# Altium schematic sheet 01 SoM IO INTERFACE.SchDoc
size A2; SheetNumber: 2; SheetTotal: 10
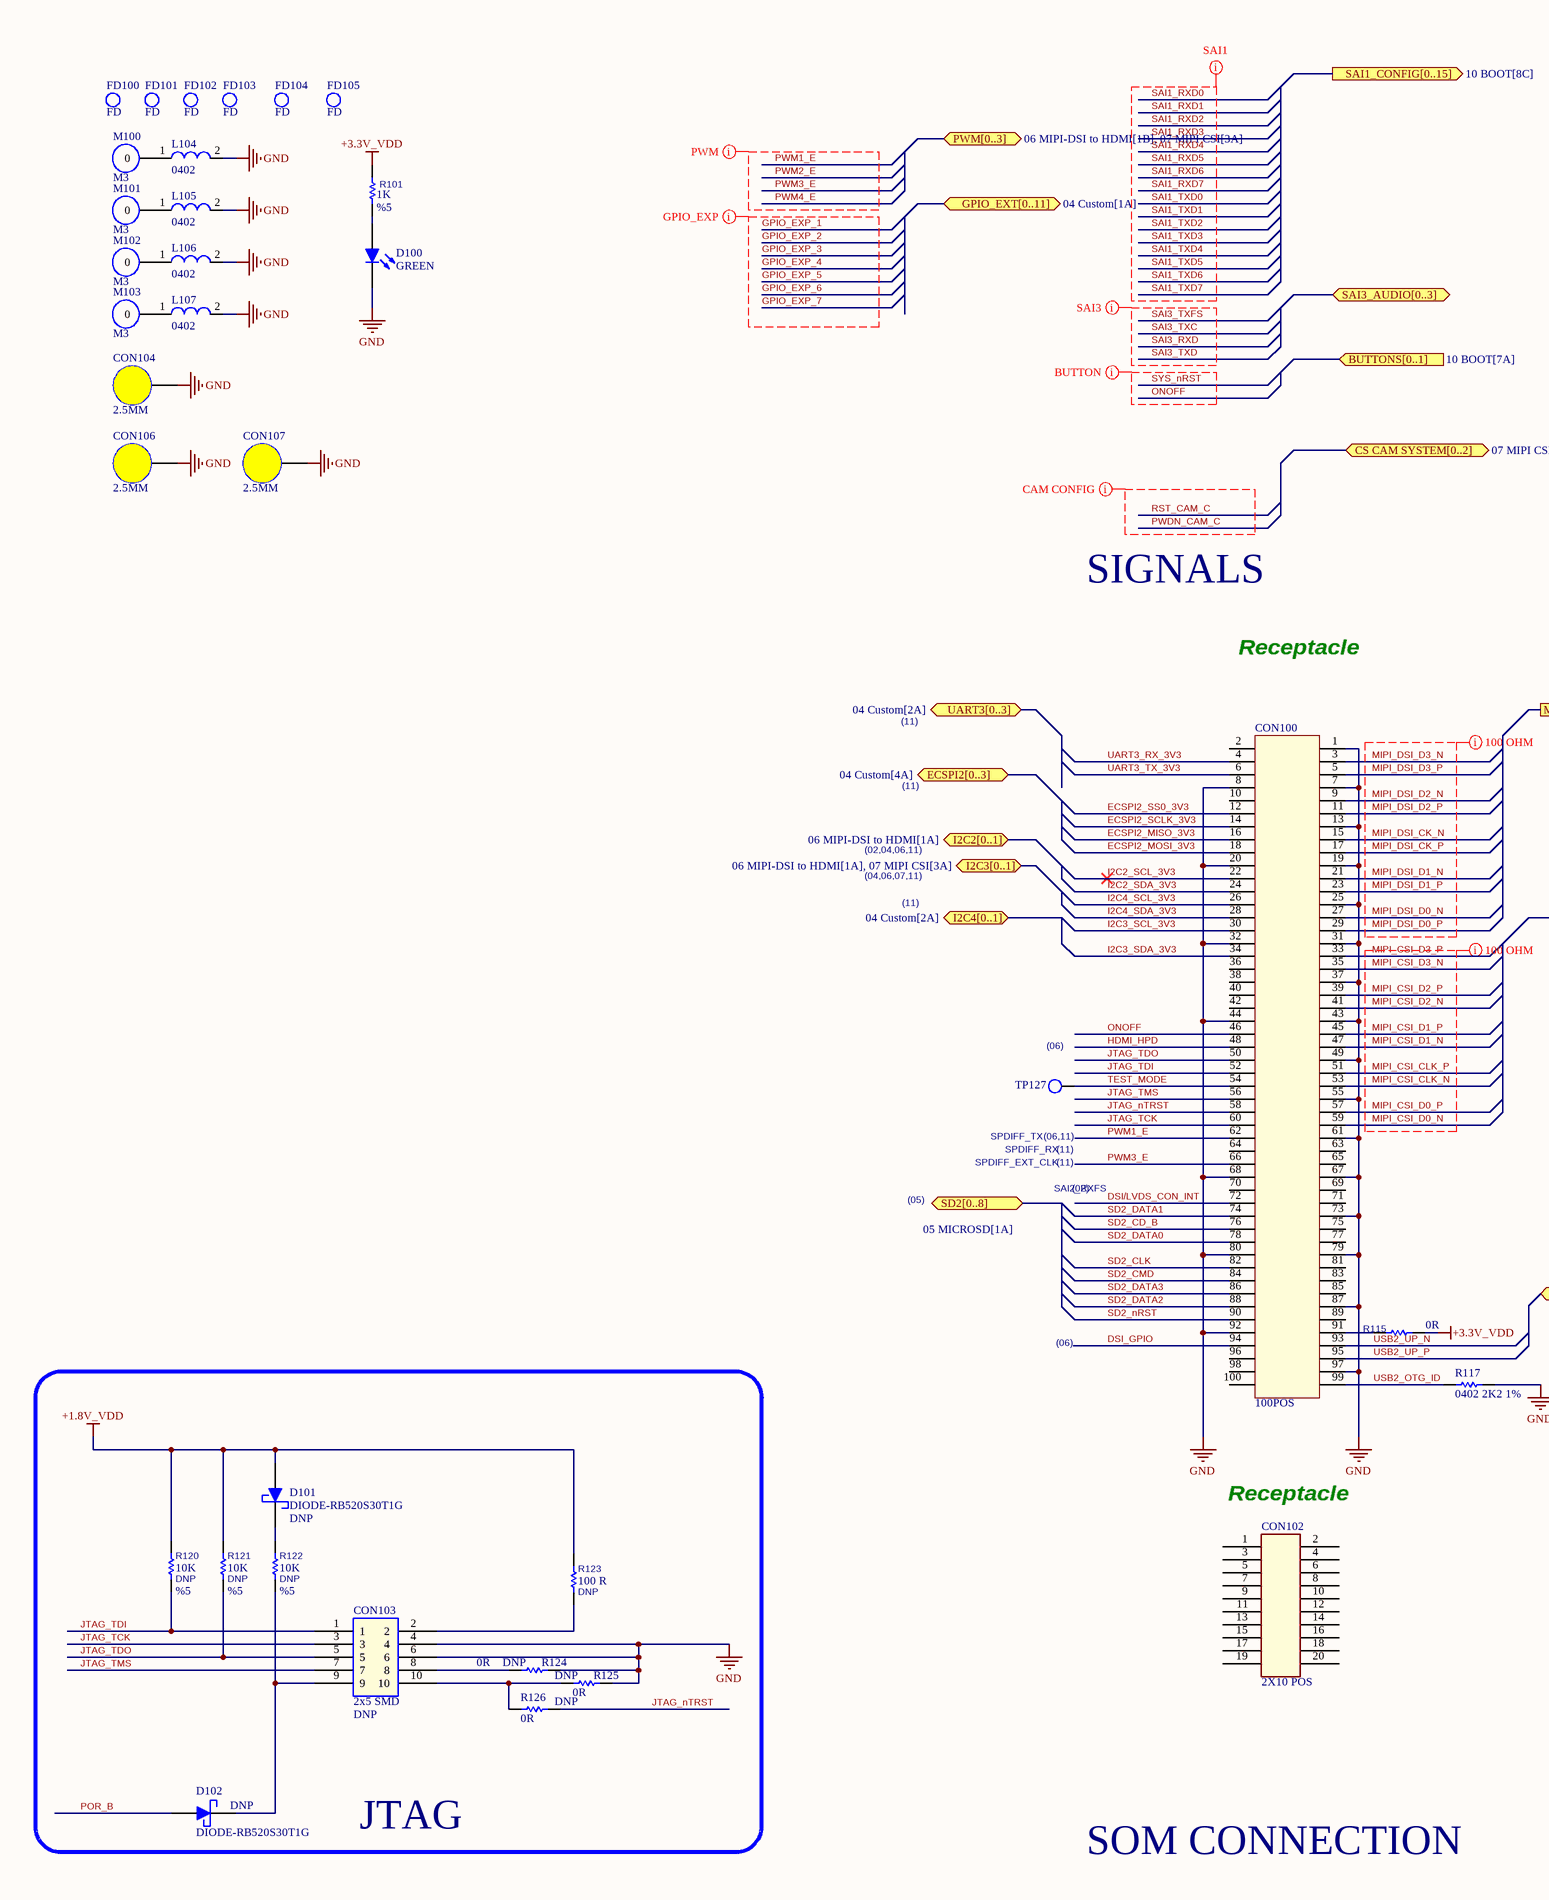
[diagram p0: 01 SoM IO INTERFACE.SchDoc, left]
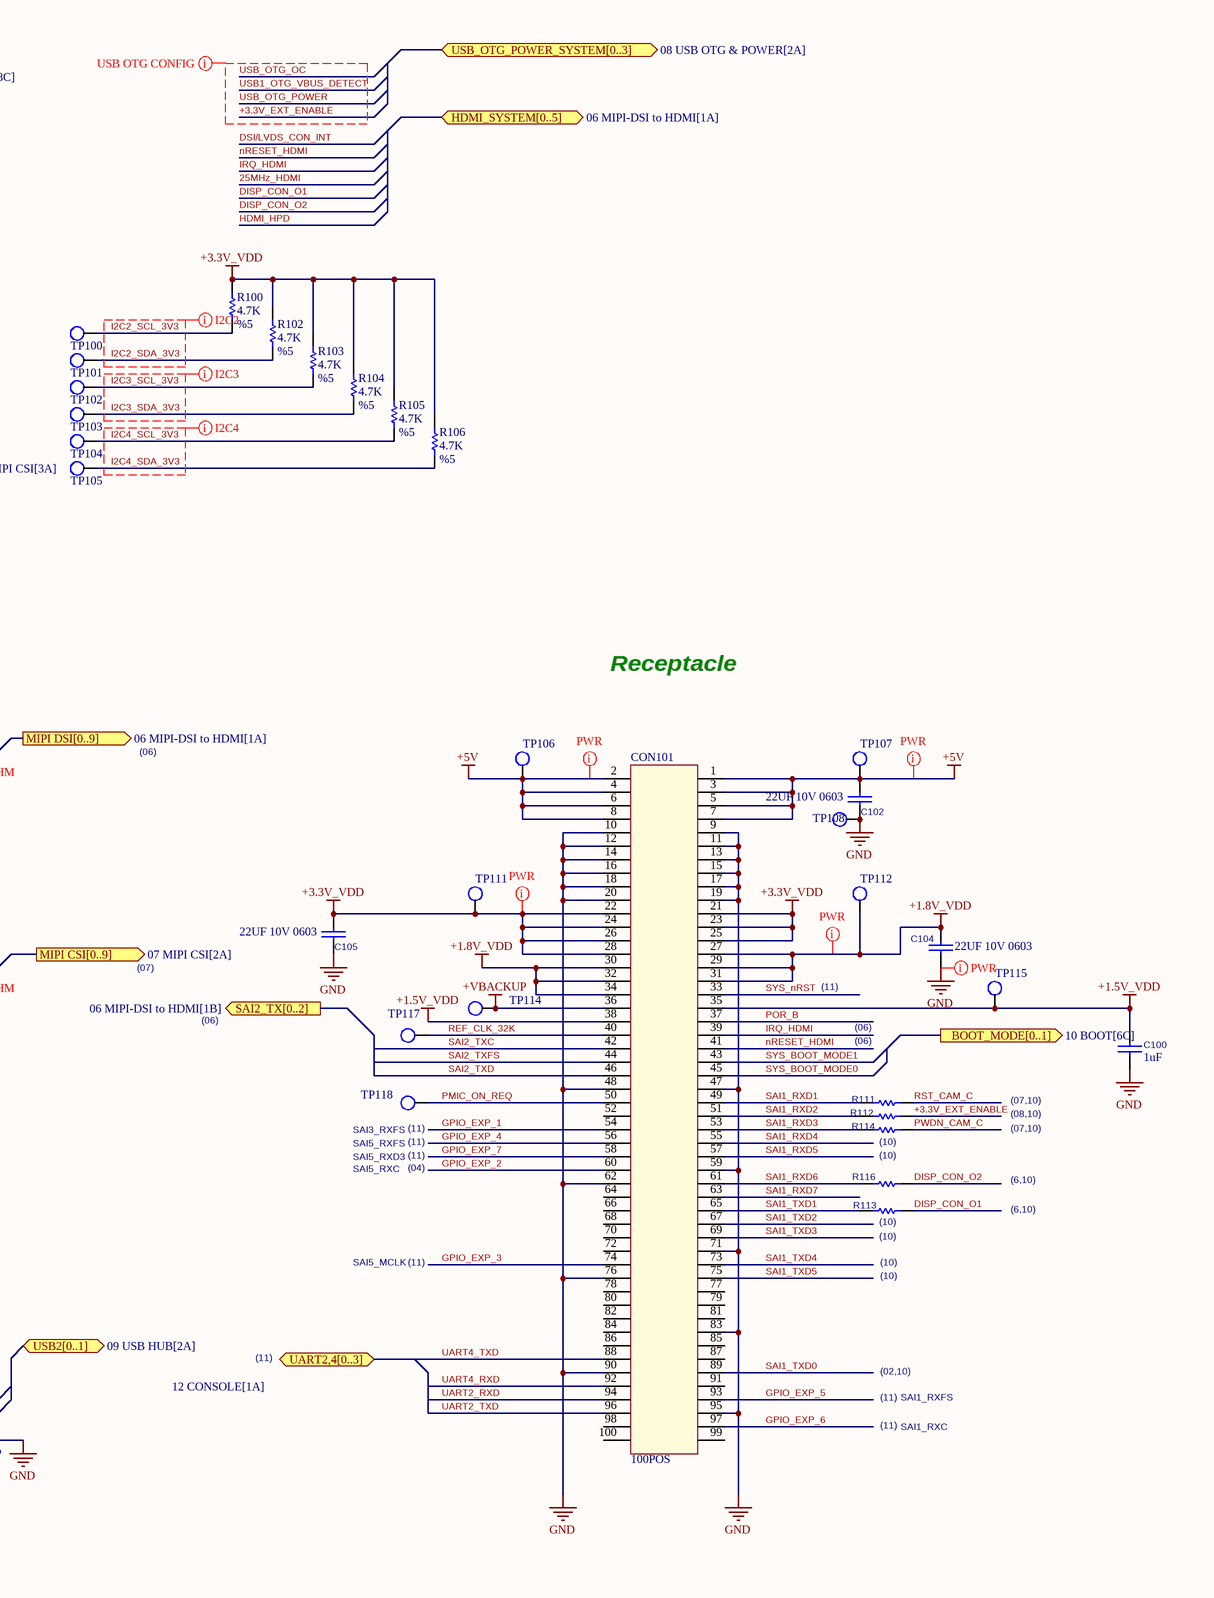
[diagram p1: 01 SoM IO INTERFACE.SchDoc, right]

## Parts
C100  1uF  [0603_CC]
C102  22UF 10V 0603  [0603_CC]
C104  22UF 10V 0603  [0603_CC]
C105  22UF 10V 0603  [0603_CC]
CON100  100POS  [DF40C-100DS- FEMALE]
CON101  100POS  [DF40C-100DS- FEMALE]
CON102  2X10 POS  [DF40C-20DS-0.4V(51)]
CON103  2x5 SMD  ASSY_OPT: DNP  [HEADER 2X5 1.27MM THD]  (no BOM)
CON104  2.5MM  [9774030151R]
CON106  2.5MM  [9774030151R]
CON107  2.5MM  [9774030151R]
D100  GREEN  [0603_LED]
D101  DIODE-RB520S30T1G  ASSY_OPT: DNP  [SOD523]  (no BOM)
D102  DIODE-RB520S30T1G  ASSY_OPT: DNP  [SOD523]  (no BOM)
FD100  FD  [FD]
FD101  FD  [FD]
FD102  FD  [FD]
FD103  FD  [FD]
FD104  FD  [FD]
FD105  FD  [FD]
L104  0402  [0402_RES]
L105  0402  [0402_RES]
L106  0402  [0402_RES]
L107  0402  [0402_RES]
M100  M3  [M3]  (no BOM)
M101  M3  [M3]  (no BOM)
M102  M3  [M3]  (no BOM)
M103  M3  [M3]  (no BOM)
R100  4.7K  Tolerance: %5  [0402_RES]
R101  1K  Tolerance: %5  [0402_RES]
R102  4.7K  Tolerance: %5  [0402_RES]
R103  4.7K  Tolerance: %5  [0402_RES]
R104  4.7K  Tolerance: %5  [0402_RES]
R105  4.7K  Tolerance: %5  [0402_RES]
R106  4.7K  Tolerance: %5  [0402_RES]
R111  0402 330R 5%  [0402_RES]  (value not drawn)
R112  0402 330R 5%  [0402_RES]  (value not drawn)
R113  0402 330R 5%  [0402_RES]  (value not drawn)
R114  0402 330R 5%  [0402_RES]  (value not drawn)
R115  0R  [0402_RES]
R116  0402 330R 5%  [0402_RES]  (value not drawn)
R117  0402 2K2 1%  [0402_RES]
R120  10K  ASSY_OPT: DNP  Tolerance: %5  [0402_RES]  (no BOM)
R121  10K  ASSY_OPT: DNP  Tolerance: %5  [0402_RES]  (no BOM)
R122  10K  ASSY_OPT: DNP  Tolerance: %5  [0402_RES]  (no BOM)
R123  100 R  ASSY_OPT: DNP  [0603_RES]  (no BOM)
R124  0R  ASSY_OPT: DNP  [0402_RES]  (no BOM)
R125  0R  ASSY_OPT: DNP  [0402_RES]  (no BOM)
R126  0R  ASSY_OPT: DNP  [0402_RES]  (no BOM)
TP100  TEST POINT 35  [testpoint_35mil]  (value not drawn)  (no BOM)
TP101  TEST POINT 35  [testpoint_35mil]  (value not drawn)  (no BOM)
TP102  TEST POINT 35  [testpoint_35mil]  (value not drawn)  (no BOM)
TP103  TEST POINT 35  [testpoint_35mil]  (value not drawn)  (no BOM)
TP104  TEST POINT 35  [testpoint_35mil]  (value not drawn)  (no BOM)
TP105  TEST POINT 35  [testpoint_35mil]  (value not drawn)  (no BOM)
TP106  TEST POINT 35  [testpoint_35mil]  (value not drawn)  (no BOM)
TP107  TEST POINT 35  [testpoint_35mil]  (value not drawn)  (no BOM)
TP108  TEST POINT 35  [testpoint_35mil]  (value not drawn)  (no BOM)
TP111  TEST POINT 35  [testpoint_35mil]  (value not drawn)  (no BOM)
TP112  TEST POINT 35  [testpoint_35mil]  (value not drawn)  (no BOM)
TP114  TEST POINT 35  [testpoint_35mil]  (value not drawn)  (no BOM)
TP115  TEST POINT 35  [testpoint_35mil]  (value not drawn)  (no BOM)
TP117  TEST POINT 15  [testpoint_15]  (value not drawn)  (no BOM)
TP118  TEST POINT 15  [testpoint_15]  (value not drawn)  (no BOM)
TP127  TEST POINT 35  [testpoint_35mil]  (value not drawn)  (no BOM)

## Blocks framed on the sheet
JTAG: CON103 D101 D102 R120-R126

## Ports
BOOT_MODE[0..1] (out, see 10 BOOT[6C]), BUTTONS[0..1] (in, see 10 BOOT[7A]), CS CAM SYSTEM[0..2] (bidir, see 07 MIPI CSI[3A]), ECSPI2[0..3] (bidir, see 04 Custom[4A]), GPIO_EXT[0..11] (bidir, see 04 Custom[1A]), HDMI_SYSTEM[0..5] (bidir, see 06 MIPI-DSI to HDMI[1A]), I2C2[0..1] (bidir, see 06 MIPI-DSI to HDMI[1A]), I2C3[0..1] (bidir, see 06 MIPI-DSI to HDMI[1A], 07 MIPI CSI[3A]), I2C4[0..1] (bidir, see 04 Custom[2A]), MIPI CSI[0..9] (out, see 07 MIPI CSI[2A]), MIPI DSI[0..9] (out, see 06 MIPI-DSI to HDMI[1A]), PWM[0..3] (bidir, see 06 MIPI-DSI to HDMI[1B], 07 MIPI CSI[3A]), SAI1_CONFIG[0..15] (out, see 10 BOOT[8C]), SAI2_TX[0..2] (out, see 06 MIPI-DSI to HDMI[1B]), SAI3_AUDIO[0..3] (bidir), SD2[0..8] (bidir, see 05 MICROSD[1A]), UART2,4[0..3] (bidir, see 12 CONSOLE[1A]), UART3[0..3] (bidir, see 04 Custom[2A]), USB2[0..1] (bidir, see 09 USB HUB[2A]), USB_OTG_POWER_SYSTEM[0..3] (bidir, see 08 USB OTG & POWER[2A])

## Nets
+1.5V_VDD: C100.2 CON101.35(P35) CON101.38(P38) TP115.1
+1.8V_VDD: C104.1 CON101.27(P27) CON101.29(P29) CON101.30(P30) CON101.31(P31) CON101.32(P32) CON101.34(P34) D101.1(A) R120.2 R121.2 R123.2 TP112.1
+3.3V_VDD: C105.1 CON101.21(P21) CON101.22(P22) CON101.23(P23) CON101.24(P24) CON101.25(P25) CON101.26(P26) CON101.28(P28) R100.2 R101.1 R102.2 R103.2 R104.2 R105.2 R106.2 R115.1 TP111.1
+5V: C102.1 CON101.1(P1) CON101.2(P2) CON101.3(P3) CON101.4(P4) CON101.5(P5) CON101.6(P6) CON101.7(P7) CON101.8(P8) TP106.1 TP107.1
+VBACKUP: CON101.36(P36) TP114.1
GND: C100.1 C102.2 C104.2 C105.2 CON100.1(P1) CON100.7(P7) CON100.8(P8) CON100.13(P13) CON100.19(P19) CON100.20(P20) CON100.25(P25) CON100.31(P31) CON100.32(P32) CON100.37(P37) CON100.43(P43) CON100.44(P44) CON100.49(P49) CON100.55(P55) CON100.61(P61) CON100.67(P67) CON100.68(P68) CON100.73(P73) CON100.79(P79) CON100.80(P80) CON100.87(P87) CON100.92(P92) CON100.97(P97) CON101.9(P9) CON101.10(P10) CON101.11(P11) CON101.12(P12) CON101.13(P13) CON101.14(P14) CON101.15(P15) CON101.16(P16) CON101.17(P17) CON101.18(P18) CON101.19(P19) CON101.20(P20) CON101.47(P47) CON101.48(P48) CON101.59(P59) CON101.62(P62) CON101.71(P71) CON101.76(P76) CON101.83(P83) CON101.90(P90) CON101.95(P95) CON103.4 CON103.6 CON104.0 CON106.0 CON107.0 D100.2(K) L104.2 L105.2 L106.2 L107.2 R117.2 R124.2 R125.2 TP108.1
+3.3V_EXT_ENABLE: R112.2
DISP_CON_O1: R113.1
DISP_CON_O2: R116.1
DSI/LVDS_CON_INT: CON100.72(P72)
DSI_GPIO: CON100.94(P94)
ECSPI2_MISO_3V3: CON100.16(P16)
ECSPI2_MOSI_3V3: CON100.18(P18)
ECSPI2_SCLK_3V3: CON100.14(P14)
ECSPI2_SS0_3V3: CON100.12(P12)
GPIO_EXP_1: CON101.54(P54)
GPIO_EXP_2: CON101.60(P60)
GPIO_EXP_3: CON101.74(P74)
GPIO_EXP_4: CON101.56(P56)
GPIO_EXP_5: CON101.93(P93)
GPIO_EXP_6: CON101.97(P97)
GPIO_EXP_7: CON101.58(P58)
HDMI_HPD: CON100.48(P48)
I2C2_SCL_3V3: CON100.22(P22) R100.1 TP100.1
I2C2_SDA_3V3: CON100.24(P24) R102.1 TP101.1
I2C3_SCL_3V3: CON100.30(P30) R103.1 TP102.1
I2C3_SDA_3V3: CON100.34(P34) R104.1 TP103.1
I2C4_SCL_3V3: CON100.26(P26) R105.1 TP104.1
I2C4_SDA_3V3: CON100.28(P28) R106.1 TP105.1
IRQ_HDMI: CON101.39(P39)
JTAG_nTRST: CON100.58(P58) R126.2
JTAG_TCK: CON100.60(P60) CON103.3
JTAG_TDI: CON100.52(P52) CON103.1 R120.1
JTAG_TDO: CON100.50(P50) CON103.5 R121.1
JTAG_TMS: CON100.56(P56) CON103.7
MIPI_CSI_CLK_N: CON100.53(P53)
MIPI_CSI_CLK_P: CON100.51(P51)
MIPI_CSI_D0_N: CON100.59(P59)
MIPI_CSI_D0_P: CON100.57(P57)
MIPI_CSI_D1_N: CON100.47(P47)
MIPI_CSI_D1_P: CON100.45(P45)
MIPI_CSI_D2_N: CON100.41(P41)
MIPI_CSI_D2_P: CON100.39(P39)
MIPI_CSI_D3_N: CON100.35(P35)
MIPI_CSI_D3_P: CON100.33(P33)
MIPI_DSI_CK_N: CON100.15(P15)
MIPI_DSI_CK_P: CON100.17(P17)
MIPI_DSI_D0_N: CON100.27(P27)
MIPI_DSI_D0_P: CON100.29(P29)
MIPI_DSI_D1_N: CON100.21(P21)
MIPI_DSI_D1_P: CON100.23(P23)
MIPI_DSI_D2_N: CON100.9(P9)
MIPI_DSI_D2_P: CON100.11(P11)
MIPI_DSI_D3_N: CON100.3(P3)
MIPI_DSI_D3_P: CON100.5(P5)
nRESET_HDMI: CON101.41(P41)
ONOFF: CON100.46(P46)
PMIC_ON_REQ: CON101.50(P50) TP118.1
POR_B: CON101.37(P37) D102.1(A)
PWDN_CAM_C: R114.2
PWM1_E: CON100.62(P62)
PWM3_E: CON100.66(P66)
REF_CLK_32K: CON101.40(P40) TP117.1
RST_CAM_C: R111.2
SAI1_RXD1: CON101.49(P49) R111.1
SAI1_RXD2: CON101.51(P51) R112.1
SAI1_RXD3: CON101.53(P53) R114.1
SAI1_RXD4: CON101.55(P55)
SAI1_RXD5: CON101.57(P57)
SAI1_RXD6: CON101.61(P61) R116.2
SAI1_RXD7: CON101.63(P63)
SAI1_TXD0: CON101.89(P89)
SAI1_TXD1: CON101.65(P65) R113.2
SAI1_TXD2: CON101.67(P67)
SAI1_TXD3: CON101.69(P69)
SAI1_TXD4: CON101.73(P73)
SAI1_TXD5: CON101.75(P75)
SAI2_TXC: CON101.42(P42)
SAI2_TXD: CON101.46(P46)
SAI2_TXFS: CON101.44(P44)
SD2_CD_B: CON100.76(P76)
SD2_CLK: CON100.82(P82)
SD2_CMD: CON100.84(P84)
SD2_DATA0: CON100.78(P78)
SD2_DATA1: CON100.74(P74)
SD2_DATA2: CON100.88(P88)
SD2_DATA3: CON100.86(P86)
SD2_nRST: CON100.90(P90)
SYS_BOOT_MODE0: CON101.45(P45)
SYS_BOOT_MODE1: CON101.43(P43)
SYS_nRST: CON101.33(P33)
TEST_MODE: CON100.54(P54) TP127.1
UART2_RXD: CON101.94(P94)
UART2_TXD: CON101.96(P96)
UART3_RX_3V3: CON100.4(P4)
UART3_TX_3V3: CON100.6(P6)
UART4_RXD: CON101.92(P92)
UART4_TXD: CON101.88(P88)
USB2_OTG_ID: CON100.99(P99) R117.1
USB2_UP_N: CON100.93(P93)
USB2_UP_P: CON100.95(P95)
NetCON100_91: CON100.91(P91) R115.2
NetCON103_2: CON103.2 R123.1
NetCON103_8: CON103.8 R124.1
NetCON103_9: CON103.9 D102.2(K) R122.1
NetCON103_10: CON103.10 R125.1 R126.1
NetD100_1: D100.1(A) R101.2
NetD101_2: D101.2(K) R122.2
NetL104_1: L104.1 M100.0
NetL105_1: L105.1 M101.0
NetL106_1: L106.1 M102.0
NetL107_1: L107.1 M103.0

Not connected (* = marked no-connect by the designer): CON100 2(P2) 10(P10) 36(P36) 38(P38) 40(P40) 42(P42) 63(P63) 64(P64) 65(P65) 69(P69) 70(P70) 71(P71) 75(P75) 77(P77) 81(P81) 83(P83) 85(P85) 89(P89) 96(P96) 98(P98) 100(P100); CON101 52(P52) 64(P64) 66(P66) 68(P68) 70(P70) 72(P72) 77(P77) 78(P78) 79(P79) 80(P80) 81(P81) 82(P82) 84(P84) 85(P85) 86(P86) 87(P87) 91(P91) 98(P98) 99(P99) 100(P100); CON102 1 2 3 4 5 6 7 8 9 10 11 12 13 14 15 16 17 18 19 20

## Layout directives
differential pair; differential pair class DIFF DSI 100 OHM; net class MIPI DSI: MIPI_DSI_CK_N, MIPI_DSI_CK_P, MIPI_DSI_D0_N, MIPI_DSI_D0_P, MIPI_DSI_D1_N, MIPI_DSI_D1_P, MIPI_DSI_D2_N, MIPI_DSI_D2_P, MIPI_DSI_D3_N, MIPI_DSI_D3_P
differential pair; differential pair class DIFF CSI 100 OHM; net class MIPI CSI: MIPI_CSI_CLK_N, MIPI_CSI_CLK_P, MIPI_CSI_D0_N, MIPI_CSI_D0_P, MIPI_CSI_D1_N, MIPI_CSI_D1_P, MIPI_CSI_D2_N, MIPI_CSI_D2_P, MIPI_CSI_D3_N, MIPI_CSI_D3_P
net class SAI1: SAI1_RXD0, SAI1_RXD1, SAI1_RXD2, SAI1_RXD3, SAI1_RXD4, SAI1_RXD5, SAI1_RXD6, SAI1_RXD7, SAI1_TXD0, SAI1_TXD1, SAI1_TXD2, SAI1_TXD3, SAI1_TXD4, SAI1_TXD5, SAI1_TXD6, SAI1_TXD7
net class PWM: PWM1_E, PWM2_E, PWM3_E, PWM4_E
net class GPIO_EXP: GPIO_EXP_1, GPIO_EXP_2, GPIO_EXP_3, GPIO_EXP_4, GPIO_EXP_5, GPIO_EXP_6, GPIO_EXP_7
net class CAM CONFIG: PWDN_CAM_C, RST_CAM_C
net class SAI3: SAI3_RXD, SAI3_TXC, SAI3_TXD, SAI3_TXFS
net class BUTTON: ONOFF, SYS_nRST
net class USB OTG CONFIG: +3.3V_EXT_ENABLE, USB1_OTG_VBUS_DETECT, USB_OTG_OC, USB_OTG_POWER
net class I2C2: I2C2_SCL_3V3, I2C2_SDA_3V3
net class I2C3: I2C3_SCL_3V3, I2C3_SDA_3V3
net class I2C4: I2C4_SCL_3V3, I2C4_SDA_3V3
net class PWR: +1.8V_VDD, +3.3V_VDD, +5V, GND

## Notes on the sheet
- SIGNALS
- Receptacle
- (11)
- (06)
- (02,04,06,11)
- (04,06,07,11)
- (07)
- (near TP115) (03)
- (near TP127) (06)
- (08,10)
- (07,10)
- SPDIFF_TX
- (near TP127) (06,11)
- (near TP118) SAI5_RXD3
- (near TP118) SAI3_RXFS
- (near TP118) SAI5_RXFS
- SAI5_RXC
- (near TP118) (11)
- (04)
- (near R114) (10)
- (10)
- (6,10)
- (05)
- SPDIFF_EXT_CLK
- SPDIFF_RX
- SAI2_RXFS
- (02)
- (near R113) (10)
- SAI5_MCLK
- (02,10)
- SAI1_RXFS
- SAI1_RXC
- (near CON102) Receptacle
- SOM CONNECTION
- Sheet Title:
- Project:
- Inventron
- Electronics and Software
- Size:
- Date:
- Drawn By:
- Revision:
- Checked By:
- A4
- Sheet
- Time:
- of
- Budotek Teknopark
- Dudullu OSB
- Des 2. Cadde No:8/30
- ©2020 Inventron Electronics and Software. All rights reserved.
- Umraniye / ISTANBUL

## Library data of the parts
C100 = CAP-CL10B105KA8NNNC: CAP CER 1UF 25V X7R 0603; Manufacturer-1: SAMSUNG; Class: Capacitor; Manufacturer Part Number-1: CL10B105KA8NNNC; Footprint: *; Manufacturer-2: *; Manufacturer Part Number-2: *; Inventron Stock No: *; Created By: LA; Created Date: *; Checked By: *; ASSY_OPT: *; Dimensions: *; Unit Price: *; Revision Date/Note: *; Price Break: *; Opt. Temp.: *; Features: *
C102 C104 C105 = CAP-C1608X5R1A226M080AC: ±20% 10V Ceramic Capacitor X5R 0603 (1608 Metric); Manufacturer-1: Murata Electronics; Manufacturer Part Number-1: C1608X5R1A226M080AC; Footprint: 0603; Manufacturer-2: *; Manufacturer Part Number-2: *; Inventron Stock No: *; Created By: E.E; Created Date: 2.11.2020; Checked By: *; ASSY_OPT: *; Dimensions: *; Unit Price: *; Revision Date/Note: *; Price Break: *; Opt. Temp.: *; Class: Capacitor; Features: *
CON100 CON101 = CON-DF40C-100DS-0.4V(51): CONN HDR 100POS 0.4MM SMD GOLD; Manufacturer-1: HIROSE; Class: Connector; Manufacturer Part Number-1: DF40C-100DS-0.4V(51); Footprint: 100POS 0.4MM; Manufacturer-2: *; Manufacturer Part Number-2: *; Inventron Stock No: *; Created By: EE; Created Date: 18.11.2020; Checked By: *; ASSY_OPT: *; Dimensions: *; Unit Price: 0.85; Revision Date/Note: *; Price Break: 5K
CON102 = CON-DF40C-20DS-0.4V(51): CONN RCPT 20POS SMD GOLD; Manufacturer-1: Hirose Electric Co Ltd; Class: Connector; Manufacturer Part Number-1: DF40C-20DS-0.4V(51); Footprint: 2X10; Manufacturer-2: *; Manufacturer Part Number-2: *; Inventron Stock No: *; Created By: E.E; Created Date: 8.10.2020; Checked By: *; ASSY_OPT: *; Dimensions: *; Unit Price: 0.27550; Revision Date/Note: *; Price Break: 5000; Opt. Temp.: *; Features: *
CON103 = CON-10 PIN 2.54MM TH: 10 PIN 1.27 SMD; Class: Connector; Manufacturer Part Number-1: *; Footprint: *; Manufacturer-1: *; Manufacturer-2: *; Manufacturer Part Number-2: *; Inventron Stock No: *; Created By: *; Created Date: *; Checked By: *; Dimensions: *; Unit Price: *; Revision Date/Note: *; Price Break: *; Opt. Temp.: *
CON104 CON106 CON107 = CON-9774030151R: RND STANDOFF M2X0.4 STEEL 2.5MM; Manufacturer-1: Würth Elektronik; Class: Connector; Manufacturer Part Number-1: 9774030151R; Footprint: *; Manufacturer-2: *; Manufacturer Part Number-2: *; Inventron Stock No: *; Created By: *; Created Date: *; Checked By: *; ASSY_OPT: *; Dimensions: *; Unit Price: 0.7; Revision Date/Note: *; Price Break: 700; Opt. Temp.: *; Features: *
D100 = LED-LTST-C190KRKT: LED SMD 0603 SUPER GREEN; Manufacturer-1: LITEON; Manufacturer Part Number-1: LTST-C190KRKT; Footprint: *; Manufacturer-2: *; Manufacturer Part Number-2: *; Inventron Stock No: *; Created By: *; Created Date: *; Checked By: *; ASSY_OPT: *; Dimensions: *; Unit Price: 0.03343; Revision Date/Note: *; Price Break: 4000; Opt. Temp.: *; Class: Led; Features: *
D101 D102 = DIODE-RB520S30T1G: DIODE SCHOTTKY 30V 200MA SOD523; Manufacturer-1: ON SEMI; Opt. Temp.: -55/+150; Manufacturer Part Number-1: RB520S30T1G; Footprint: SOD-523; Manufacturer-2: *; Manufacturer Part Number-2: *; Inventron Stock No: *; Created By: LA; Created Date: 23.11.2018; Checked By: *; Dimensions: *; Unit Price: 0,0324; Revision Date/Note: *; Price Break: 3K; Class: Diode
FD100-FD105 = FD: Manufacturer Part Number-1: "; Footprint: "; Manufacturer-1: "; Manufacturer-2: *; Manufacturer Part Number-2: *; Inventron Stock No: *; Created By: "; Created Date: "; Checked By: *; ASSY_OPT: *; Dimensions: *; Unit Price: "; Revision Date/Note: *; Price Break: "; Opt. Temp.: "; Class: "
L104-L107 = IND-FERRITE (RES 0 OHM) 0402: 0OHM 0402; Manufacturer Part Number-1: RMCF0402ZT0R00; Manufacturer-1: Stackpole Electronics Inc; Class: Inductor; Footprint: 0402; Manufacturer-2: *; Inventron Stock No: *; Created By: EE; Checked By: *; ASSY_OPT: *; Dimensions: *; Unit Price: 0.00186; Revision Date/Note: *; Price Break: 1000
M100-M103 = CON-M3 SCREW: M3 SCREW
R100 R102-R106 = RES-4.7K: RES 4.7K OHM 5% 1/16W 0402; Manufacturer Part Number-1: RC0402JR-074K7L; Manufacturer-1: Yageo; Opt. Temp.: -55/+155; Class: Resistor; Footprint: 0402; Manufacturer-2: *; Manufacturer Part Number-2: *; Inventron Stock No: *; Created By: LA; Checked By: *; ASSY_OPT: *; Dimensions: *; Revision Date/Note: *
R101 = RES-RMCF0402JT1K00: RES 1K OHM 5% 1/16W 0402; Manufacturer-1: STACKPOLE; Opt. Temp.: -55/+155; Class: Resistor; Manufacturer Part Number-1: RMCF0402JT1K00; Footprint: 0402; Manufacturer-2: *; Manufacturer Part Number-2: *; Inventron Stock No: *; Created By: LA; Created Date: 23.11.2018; Checked By: *; ASSY_OPT: *; Dimensions: *; Unit Price: 0,00127; Revision Date/Note: *; Price Break: 10K
R111-R114 R116 = RES-CRGCQ0402J330R: 330 ±5% 0.063W, 1/16W Chip Resistor 0402 (1005 Metric) Automotive AEC-Q200, Moisture Resistant Thick Film; Manufacturer-1: TE Connectivity Passive Product; Opt. Temp.: -55°C ~ 155°C; Tolerance: %5; Manufacturer Part Number-1: CRGCQ0402J330R; Footprint: 0402; Manufacturer-2: *; Manufacturer Part Number-2: *; Inventron Stock No: *; Created By: E.E; Created Date: 23.10.2020; Checked By: *; ASSY_OPT: *; Dimensions: *; Unit Price: *; Revision Date/Note: *; Price Break: *; Class: Resistor
R115 R124-R126 = RES-RMCF0402ZT0R00: RES 0 OHM JUMPER 1/16W 0402; Manufacturer-1: STACKPOLE; Opt. Temp.: -55/+155; Class: Resistor; Manufacturer Part Number-1: RMCF0402ZT0R00; Footprint: 0402; Manufacturer-2: *; Manufacturer Part Number-2: *; Inventron Stock No: *; Created By: LA; Created Date: 23.11.2018; Checked By: *; Dimensions: *; Unit Price: 0,00127; Revision Date/Note: *; Price Break: 10K
  R115: ASSY_OPT: *
R117 = RES-CRGCQ0402F2K2: 2.2 ±1% 0.063W, 1/16W Chip Resistor 0402 (1005 Metric) Automotive AEC-Q200, Moisture Resistant Thick Film; Manufacturer-1: TE Connectivity Passive Product; Opt. Temp.: -55°C ~ 155°C; Manufacturer Part Number-1: CRGCQ0402F2K2; Footprint: 0402; Manufacturer-2: *; Manufacturer Part Number-2: *; Inventron Stock No: *; Created By: E.E; Created Date: 22.10.2020; Checked By: *; ASSY_OPT: *; Dimensions: *; Unit Price: *; Revision Date/Note: *; Price Break: *; Class: Resistor; Tolerance: *
R120-R122 = RES-RMCF0402JT10K0: RES 10K OHM 5% 1/16W 0402; Manufacturer-1: STACKPOLE; Opt. Temp.: -55/+155; Class: Resistor; Manufacturer Part Number-1: RMCF0402JT10K0; Footprint: 0402; Manufacturer-2: *; Manufacturer Part Number-2: *; Inventron Stock No: *; Created By: LA; Created Date: 23.11.2018; Checked By: *; Dimensions: *; Unit Price: 0,00127; Revision Date/Note: *; Price Break: 10K
R123 = RES-RMCF0603FT100R: RES 100 OHM %1 1/10W 0603; Manufacturer-1: STACKPOLE; Opt. Temp.: -55/+155; Class: Resistor; Manufacturer Part Number-1: RMCF0603FT100R; Footprint: 0603; Manufacturer-2: *; Manufacturer Part Number-2: *; Inventron Stock No: *; Created By: LA; Created Date: *; Checked By: *; Dimensions: *; Unit Price: *; Revision Date/Note: *; Price Break: *; Features: AUTOMOTIVE; Tolerance: *